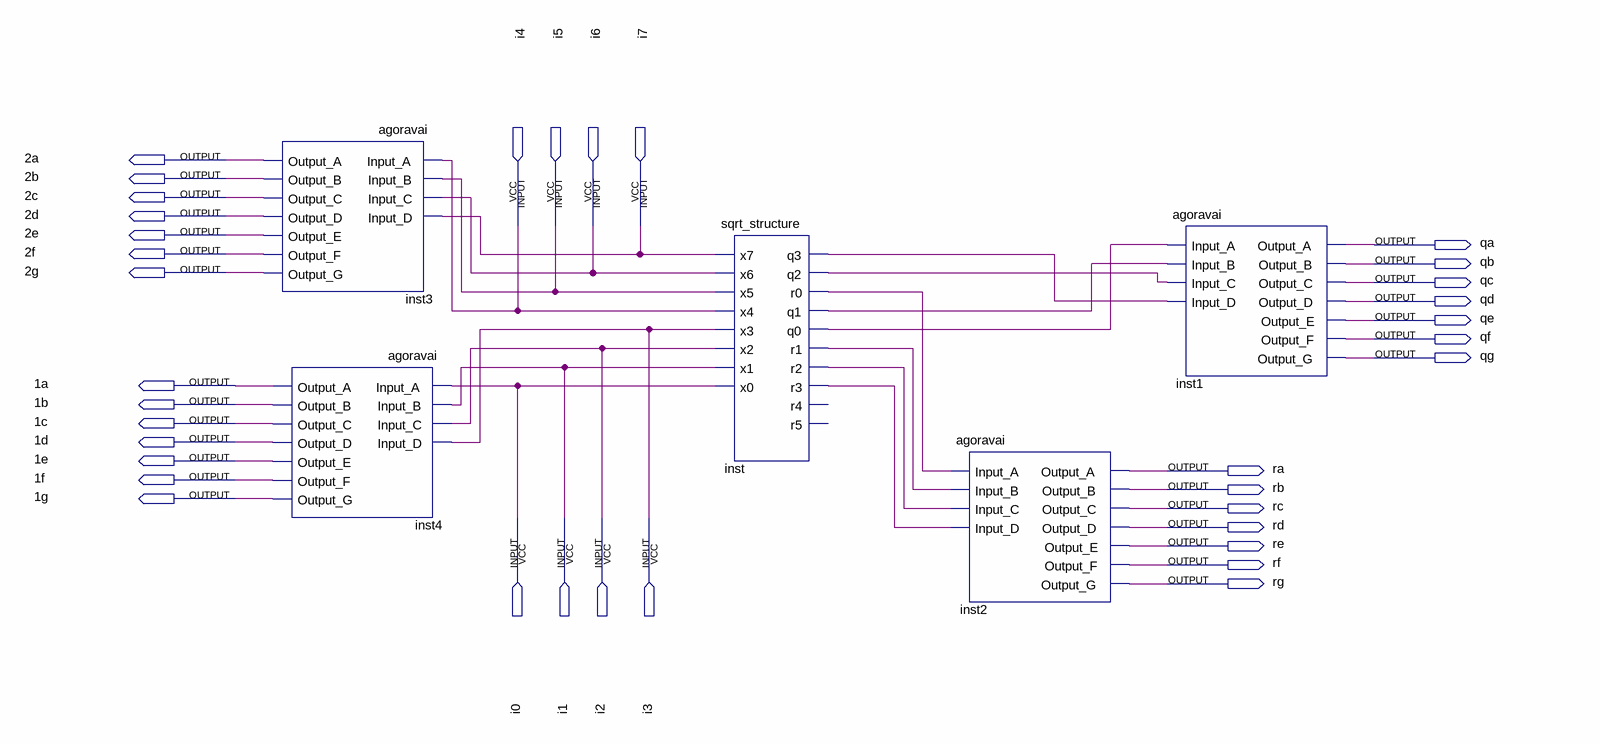
[diagram p0: schematic sheet]
// Quartus schematic sqrt_with_display2.bdf as structural Verilog: 5 symbols, 36 pins
module sqrt_with_display2 (
  input  i4,
  input  i5,
  input  i6,
  input  i7,
  input  i0,
  input  i1,
  input  i2,
  input  i3,
  output \2a ,
  output \2b ,
  output \2c ,
  output \2d ,
  output \2e ,
  output qa,
  output \2f ,
  output qb,
  output \2g ,
  output qc,
  output qd,
  output qe,
  output qf,
  output qg,
  output \1a ,
  output \1b ,
  output \1c ,
  output \1d ,
  output \1e ,
  output ra,
  output \1f ,
  output rb,
  output \1g ,
  output rc,
  output rd,
  output re,
  output rf,
  output rg
);

  wire inst_q0, inst_q1, inst_q2, inst_q3, inst_r0, inst_r1, inst_r2, inst_r3;

  agoravai inst3 (
    .Input_A(i4), .Input_B(i5), .Input_C(i6), .Input_D(i7), .Output_A(\2a ), .Output_B(\2b ),
    .Output_C(\2c ), .Output_D(\2d ), .Output_E(\2e ), .Output_F(\2f ), .Output_G(\2g ));
  agoravai inst4 (
    .Input_A(i0), .Input_B(i1), .Input_C(i2), .Input_D(i3), .Output_A(\1a ), .Output_B(\1b ),
    .Output_C(\1c ), .Output_D(\1d ), .Output_E(\1e ), .Output_F(\1f ), .Output_G(\1g ));
  sqrt_structure inst (
    .x7(i7), .x6(i6), .x5(i5), .x4(i4), .x3(i3), .x2(i2), .x1(i1), .x0(i0), .q3(inst_q3), .q2(inst_q2),
    .r0(inst_r0), .q1(inst_q1), .q0(inst_q0), .r1(inst_r1), .r2(inst_r2), .r3(inst_r3));  // open: r4, r5
  agoravai inst2 (
    .Input_A(inst_r0), .Input_B(inst_r1), .Input_C(inst_r2), .Input_D(inst_r3), .Output_A(ra), .Output_B(rb),
    .Output_C(rc), .Output_D(rd), .Output_E(re), .Output_F(rf), .Output_G(rg));
  agoravai inst1 (
    .Input_A(inst_q0), .Input_B(inst_q1), .Input_C(inst_q2), .Input_D(inst_q3), .Output_A(qa), .Output_B(qb),
    .Output_C(qc), .Output_D(qd), .Output_E(qe), .Output_F(qf), .Output_G(qg));
endmodule
